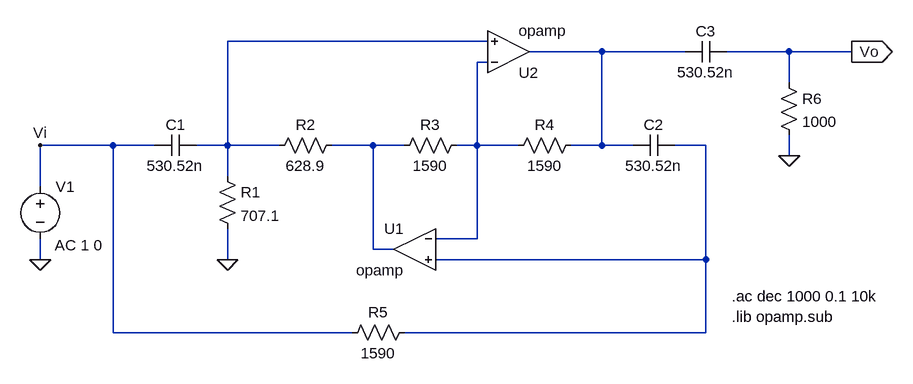
[diagram p0: schematic TS5_SimulacionLTSpice.asc]
TS5_SimulacionLTSpice.asc, the LTspice schematic file:
Version 4
SHEET 1 1208 680
WIRE 560 -80 160 -80
WIRE 736 -64 624 -64
WIRE 864 -64 736 -64
WIRE 1024 -64 928 -64
WIRE 1120 -64 1024 -64
WIRE 560 -48 544 -48
WIRE 1024 -16 1024 -64
WIRE -16 80 -128 80
WIRE 48 80 -16 80
WIRE 160 80 160 -80
WIRE 160 80 112 80
WIRE 240 80 160 80
WIRE 384 80 320 80
WIRE 432 80 384 80
WIRE 544 80 544 -48
WIRE 544 80 512 80
WIRE 608 80 544 80
WIRE 736 80 736 -64
WIRE 736 80 688 80
WIRE 784 80 736 80
WIRE 896 80 848 80
WIRE 1024 96 1024 64
WIRE 160 128 160 80
WIRE -128 144 -128 80
WIRE 544 224 544 80
WIRE 544 224 480 224
WIRE 384 240 384 80
WIRE 416 240 384 240
WIRE -128 256 -128 224
WIRE 160 256 160 208
WIRE 896 256 896 80
WIRE 896 256 480 256
WIRE -16 368 -16 80
WIRE 352 368 -16 368
WIRE 896 368 896 256
WIRE 896 368 432 368
FLAG -128 256 0
FLAG 160 256 0
FLAG 1120 -64 Vo
IOPIN 1120 -64 Out
FLAG -128 80 Vi
FLAG 1024 96 0
SYMBOL voltage -128 128 R0
WINDOW 123 22 106 Left 2
WINDOW 39 0 0 Left 0
SYMATTR InstName V1
SYMATTR Value ""
SYMATTR Value2 AC 1 0
SYMBOL cap 112 64 R90
WINDOW 0 0 32 VBottom 2
WINDOW 3 32 32 VTop 2
SYMATTR InstName C1
SYMATTR Value 530.52n
SYMBOL res 144 112 R0
SYMATTR InstName R1
SYMATTR Value 707.1
SYMBOL res 336 64 R90
WINDOW 0 0 56 VBottom 2
WINDOW 3 32 56 VTop 2
SYMATTR InstName R2
SYMATTR Value 628.9
SYMBOL res 528 64 R90
WINDOW 0 0 56 VBottom 2
WINDOW 3 32 56 VTop 2
SYMATTR InstName R3
SYMATTR Value 1590
SYMBOL res 704 64 R90
WINDOW 0 0 56 VBottom 2
WINDOW 3 32 56 VTop 2
SYMATTR InstName R4
SYMATTR Value 1590
SYMBOL res 448 352 R90
WINDOW 0 0 56 VBottom 2
WINDOW 3 32 56 VTop 2
SYMATTR InstName R5
SYMATTR Value 1590
SYMBOL cap 848 64 R90
WINDOW 0 0 32 VBottom 2
WINDOW 3 32 32 VTop 2
SYMATTR InstName C2
SYMATTR Value 530.52n
SYMBOL OpAmps\\opamp 448 176 M0
SYMATTR InstName U1
SYMBOL OpAmps\\opamp 592 0 M180
SYMATTR InstName U2
SYMBOL cap 928 -80 R90
WINDOW 0 0 32 VBottom 2
WINDOW 3 32 32 VTop 2
SYMATTR InstName C3
SYMATTR Value 530.52n
SYMBOL res 1008 -32 R0
SYMATTR InstName R6
SYMATTR Value 1000
TEXT 936 344 Left 2 !.lib opamp.sub
TEXT 936 312 Left 2 !.ac dec 1000 0.1 10k

The netlist it stands for:
* TS5_SimulacionLTSpice.asc
V1 Vi 0 AC 1 0
C1 N001 Vi 530.52n
R1 N001 0 707.1
R2 N004 N001 628.9
R3 N003 N004 1590
R4 N002 N003 1590
R5 N005 Vi 1590
C2 N005 N002 530.52n
XU1 N003 N005 N004 opamp Aol=100K GBW=10Meg  ; pins invin noninvin out
XU2 N003 N001 N002 opamp Aol=100K GBW=10Meg  ; pins invin noninvin out
C3 Vo N002 530.52n
R6 Vo 0 1000
.lib opamp.sub
.ac dec 1000 0.1 10k
.backanno
.end

* Results of the author's LTspice run, read from the files saved beside the schematic
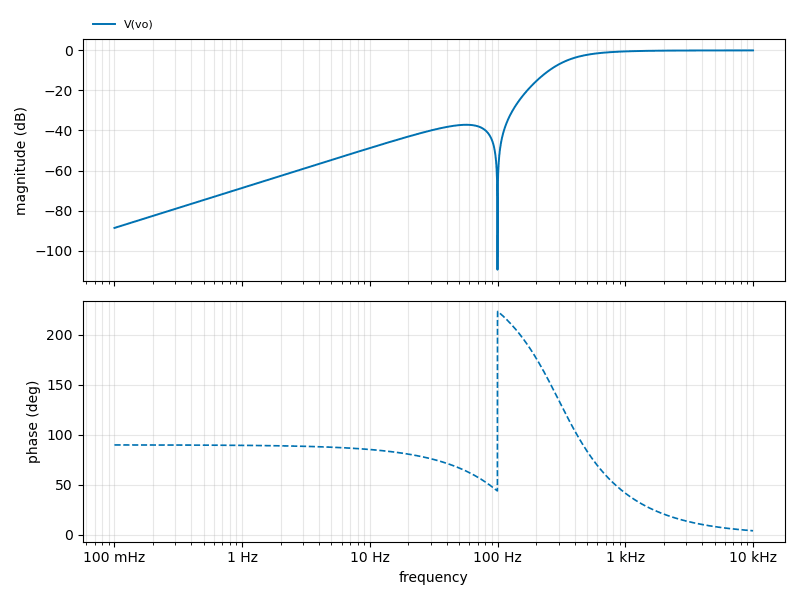
[diagram p1: AC Analysis of TS5_SimulacionLTSpice.asc, plotted from the saved traces]
* AC Analysis, 1 run:
*   V(vo): -88.67 dB at 100 mHz, -0.01 dB at 10 kHz, peak -0.01 dB at 10 kHz, 3 dB below the peak at 436.8 Hz